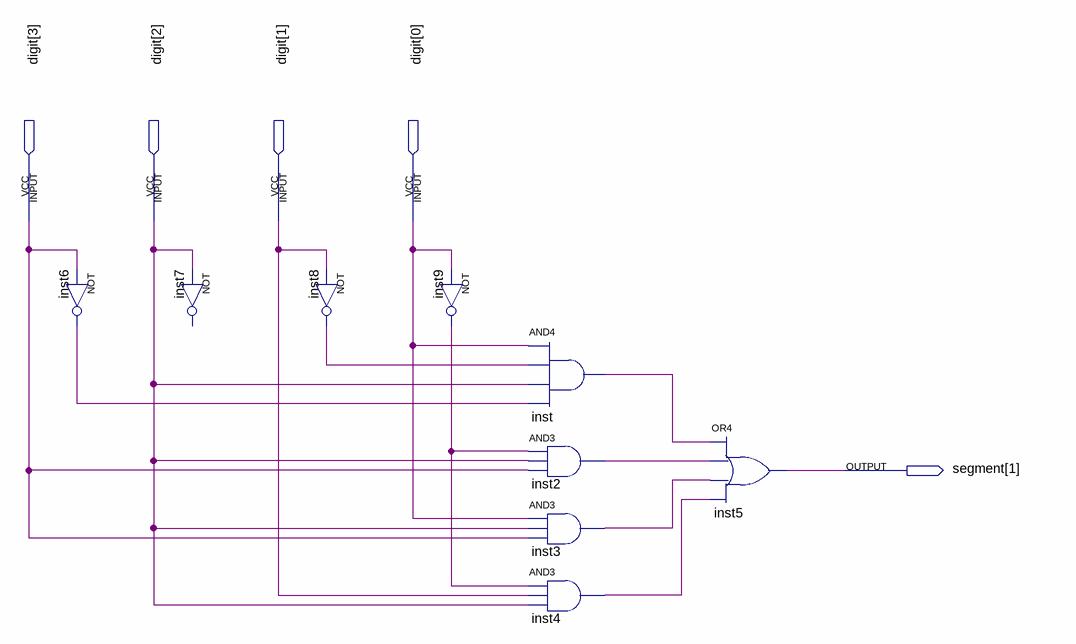
[diagram p0: schematic sheet]
// Quartus schematic segmentB.bdf as structural Verilog: 9 symbols, 5 pins
module segmentB (
  input  [3:0] digit,
  output [1:1] segment
);

  wire inst2_out, inst3_out, inst4_out, inst6_out, inst8_out, inst9_out, inst_out;

  not inst6 (inst6_out, digit[3]);
  // NOT inst7 has open pins: IN=digit[2], OUT=open
  not inst8 (inst8_out, digit[1]);
  not inst9 (inst9_out, digit[0]);
  and inst (inst_out, digit[0], inst8_out, digit[2], inst6_out);
  and inst2 (inst2_out, inst9_out, digit[2], digit[3]);
  and inst3 (inst3_out, digit[0], digit[2], digit[3]);
  and inst4 (inst4_out, inst9_out, digit[1], digit[2]);
  or inst5 (segment[1], inst_out, inst2_out, inst3_out, inst4_out);
endmodule
